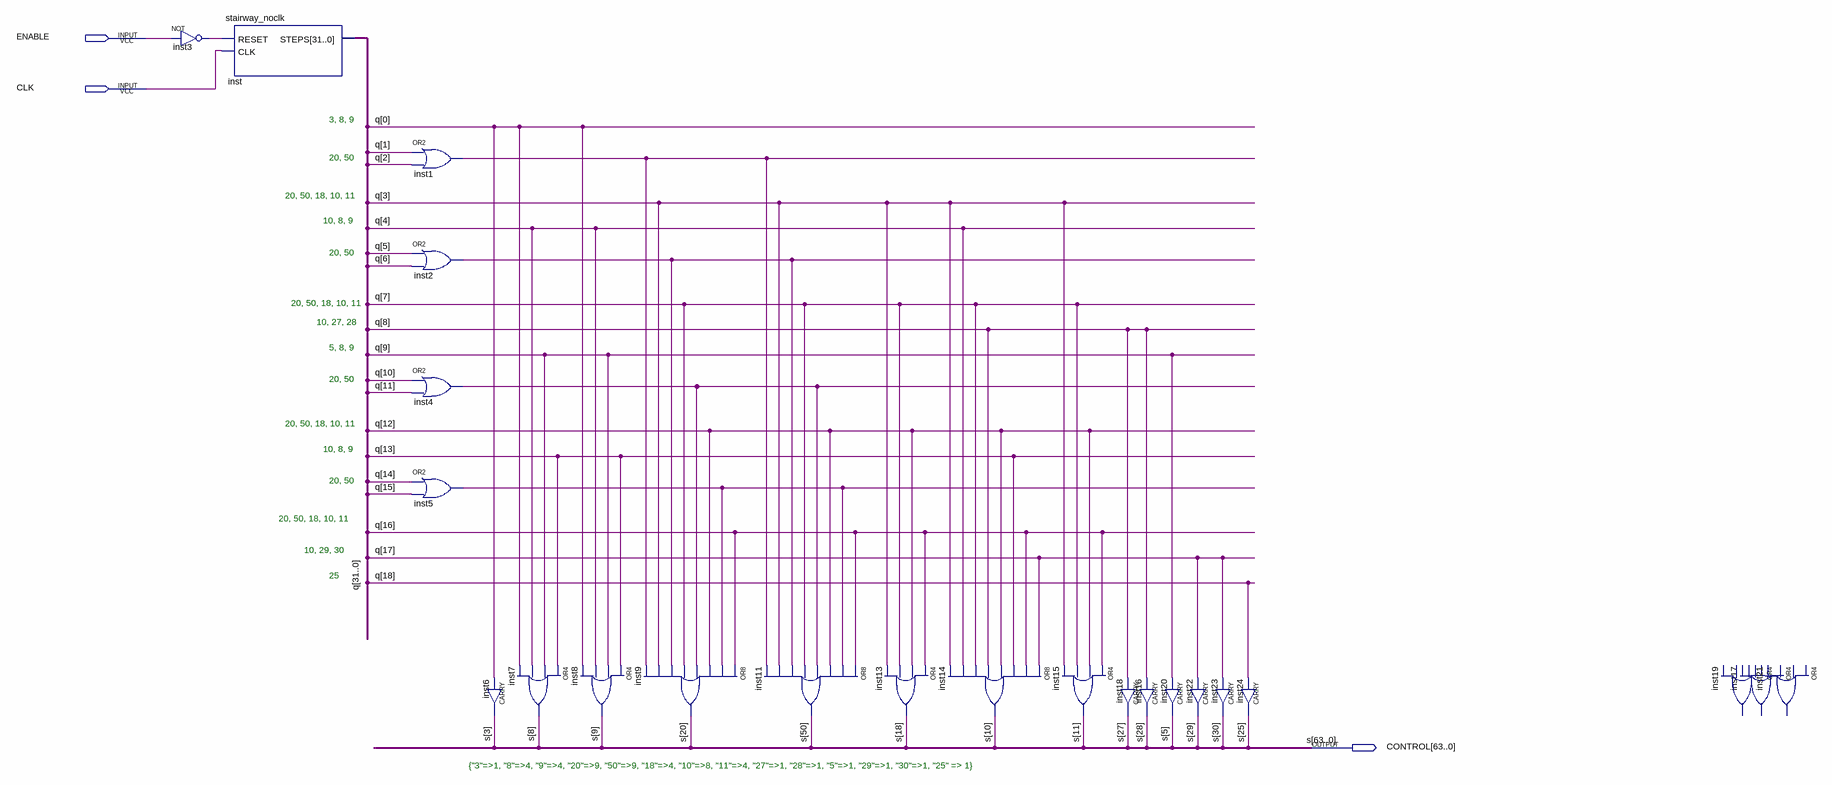
[diagram p0: schematic sheet]
// Quartus schematic macro_relative.bdf as structural Verilog: 23 symbols, 3 pins
module macro_relative (
  input  ENABLE,
  input  CLK,
  output [63:0] CONTROL
);

  wire inst1_out, inst2_out, inst3_out, inst4_out, inst5_out, undriven, undriven_2;
  wire [31:0] q;

  not inst3 (inst3_out, ENABLE);
  stairway_noclk inst (.RESET(inst3_out), .CLK(CLK), .STEPS(q));
  or inst1 (inst1_out, q[1], q[2]);
  or inst2 (inst2_out, q[5], q[6]);
  or inst4 (inst4_out, q[10], q[11]);
  or inst5 (inst5_out, q[14], q[15]);
  or inst7 (CONTROL[8], q[13], q[9], q[4], q[0]);
  CARRY inst6 (.IN(q[0]), .OUT(CONTROL[3]));
  or inst8 (CONTROL[9], q[13], q[9], q[4], q[0]);
  or inst9 (CONTROL[20], q[16], inst5_out, q[12], inst4_out, q[7], inst2_out, q[3], inst1_out);
  or inst11 (CONTROL[50], q[16], inst5_out, q[12], inst4_out, q[7], inst2_out, q[3], inst1_out);
  or inst13 (CONTROL[18], q[16], q[12], q[7], q[3]);
  or inst14 (CONTROL[10], q[17], q[16], q[13], q[12], q[8], q[7], q[4], q[3]);
  or inst15 (CONTROL[11], q[16], q[12], q[7], q[3]);
  CARRY inst18 (.IN(q[8]), .OUT(CONTROL[27]));
  CARRY inst16 (.IN(q[8]), .OUT(CONTROL[28]));
  CARRY inst20 (.IN(q[9]), .OUT(CONTROL[5]));
  CARRY inst22 (.IN(q[17]), .OUT(CONTROL[29]));
  CARRY inst23 (.IN(q[17]), .OUT(CONTROL[30]));
  CARRY inst24 (.IN(q[18]), .OUT(CONTROL[25]));
  // OR4 inst17 has open pins: IN1=undriven_2, IN2=undriven, IN3=open, IN4=open, OUT=open
  // OR4 inst19 is placed but not wired
  // OR4 inst21 has open pins: IN1=open, IN2=open, IN3=undriven_2, IN4=undriven, OUT=open

  // Other names for the same wires on the sheet: s[63:0] = CONTROL

  // Notes on the sheet:
  //   3, 8, 9
  //   20, 50
  //   20, 50, 18, 10, 11
  //   10, 8, 9
  //   20, 50
  //   20, 50, 18, 10, 11
  //   10, 27, 28
  //   5, 8, 9
  //   20, 50
  //   20, 50, 18, 10, 11
  //   10, 8, 9
  //   20, 50
  //   20, 50, 18, 10, 11
  //   10, 29, 30
  //   25
  //   {"3"=>1, "8"=>4, "9"=>4, "20"=>9, "50"=>9, "18"=>4, "10"=>8, "11"=>4, "27"=>1, "28"=>1, "5"=>1, "29"=>1, "30"=>1, "25" => 1}
endmodule
